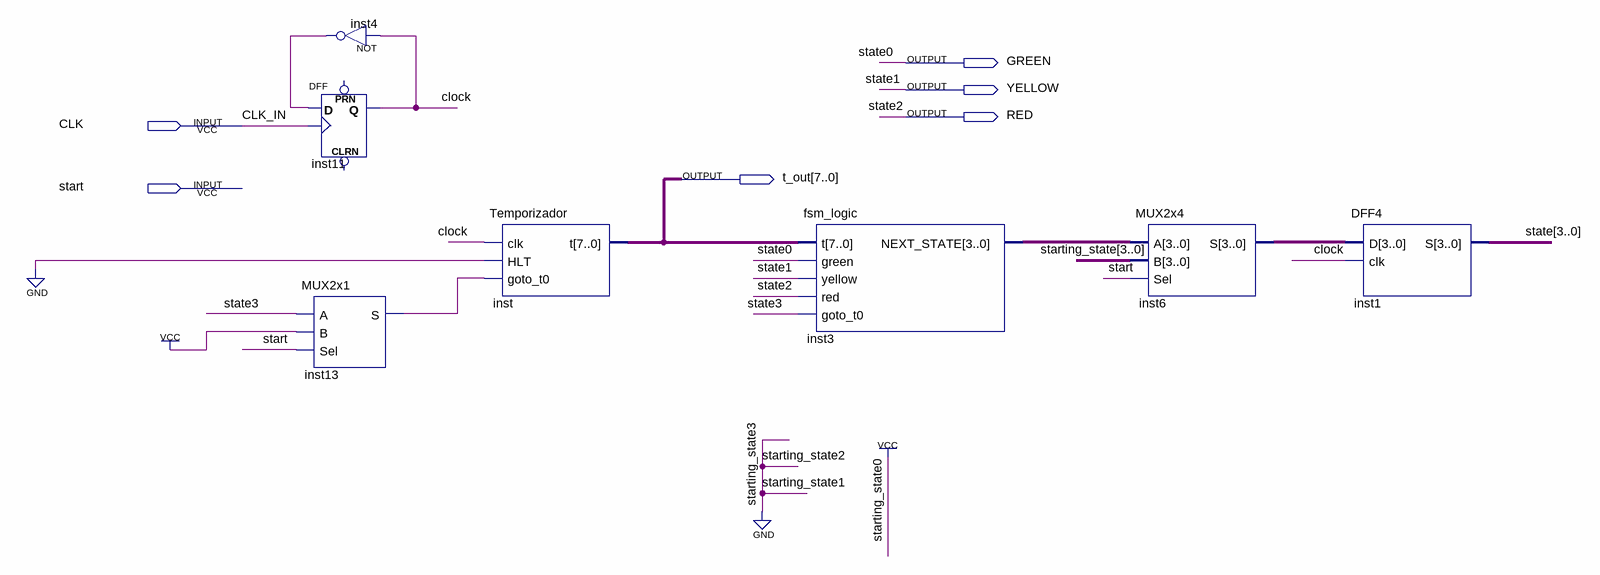
[diagram p0: schematic sheet]
// Quartus schematic FSM1.bdf as structural Verilog: 7 symbols, 6 pins
module FSM1 (
  input  CLK,
  input  start,
  output GREEN,
  output YELLOW,
  output RED,
  output [7:0] t_out
);

  wire clock, inst4_out, inst13_s;
  wire [3:0] inst3_next_state, inst6_s;
  wire [3:3] state;

  DFF inst11 (.CLK(CLK), .D(inst4_out), .Q(clock));  // open: CLRN, PRN
  MUX2x1 inst13 (.A(state[3]), .B(1'b1), .Sel(start), .S(inst13_s));
  not inst4 (inst4_out, clock);
  Temporizador inst (.clk(clock), .HLT(1'b0), .goto_t0(inst13_s), .t(t_out));
  fsm_logic inst3 (
    .t(t_out), .green(GREEN), .yellow(YELLOW), .red(RED), .goto_t0(state[3]), .NEXT_STATE(inst3_next_state));
  MUX2x4 inst6 (.A(inst3_next_state), .B(4'b0001), .Sel(start), .S(inst6_s));
  DFF4 inst1 (.D(inst6_s), .clk(clock), .S({state[3], RED, YELLOW, GREEN}));

  // Other names for the same wires on the sheet: CLK_IN = CLK; state[2:0] = {RED, YELLOW, GREEN}; state0 = GREEN;
  //   state1 = YELLOW; state2 = RED
endmodule
